# Altium schematic sheet NB-IoT_1.0.0_final.SchDoc
size 584 x 381 mm
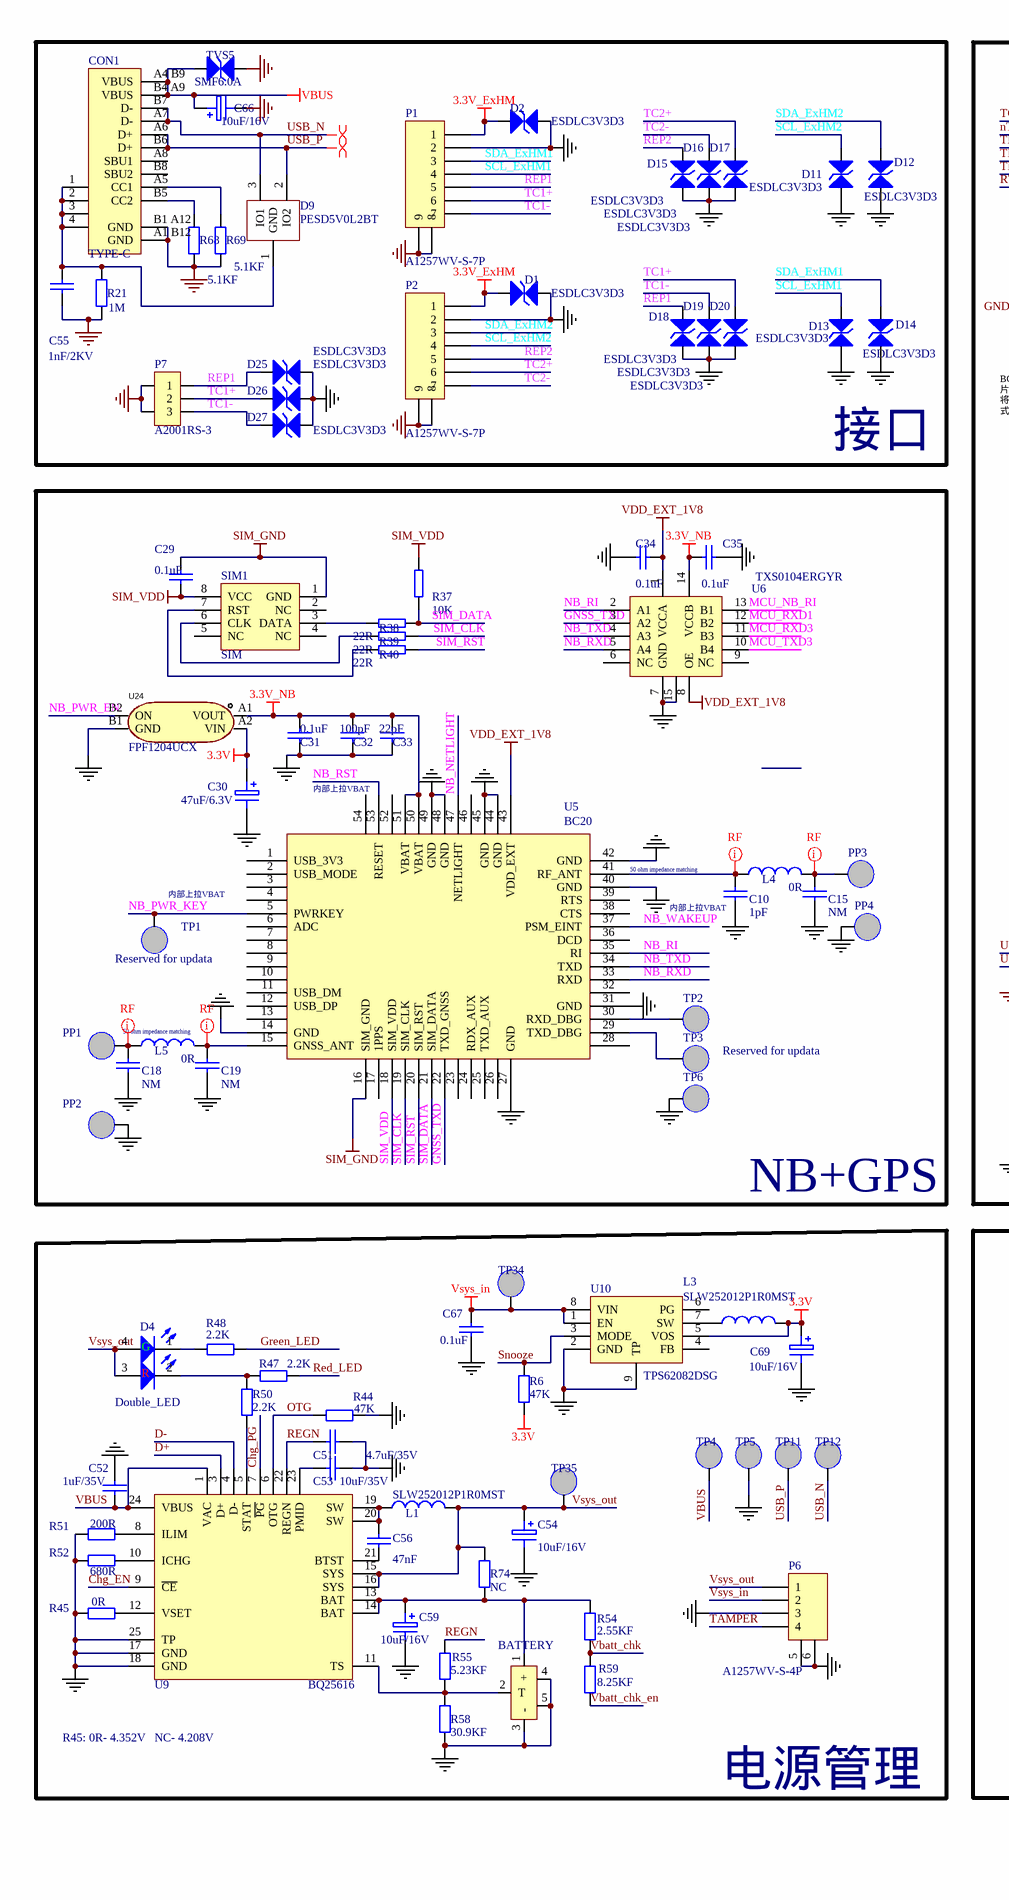
[diagram p0: NB-IoT_1.0.0_final.SchDoc, left]
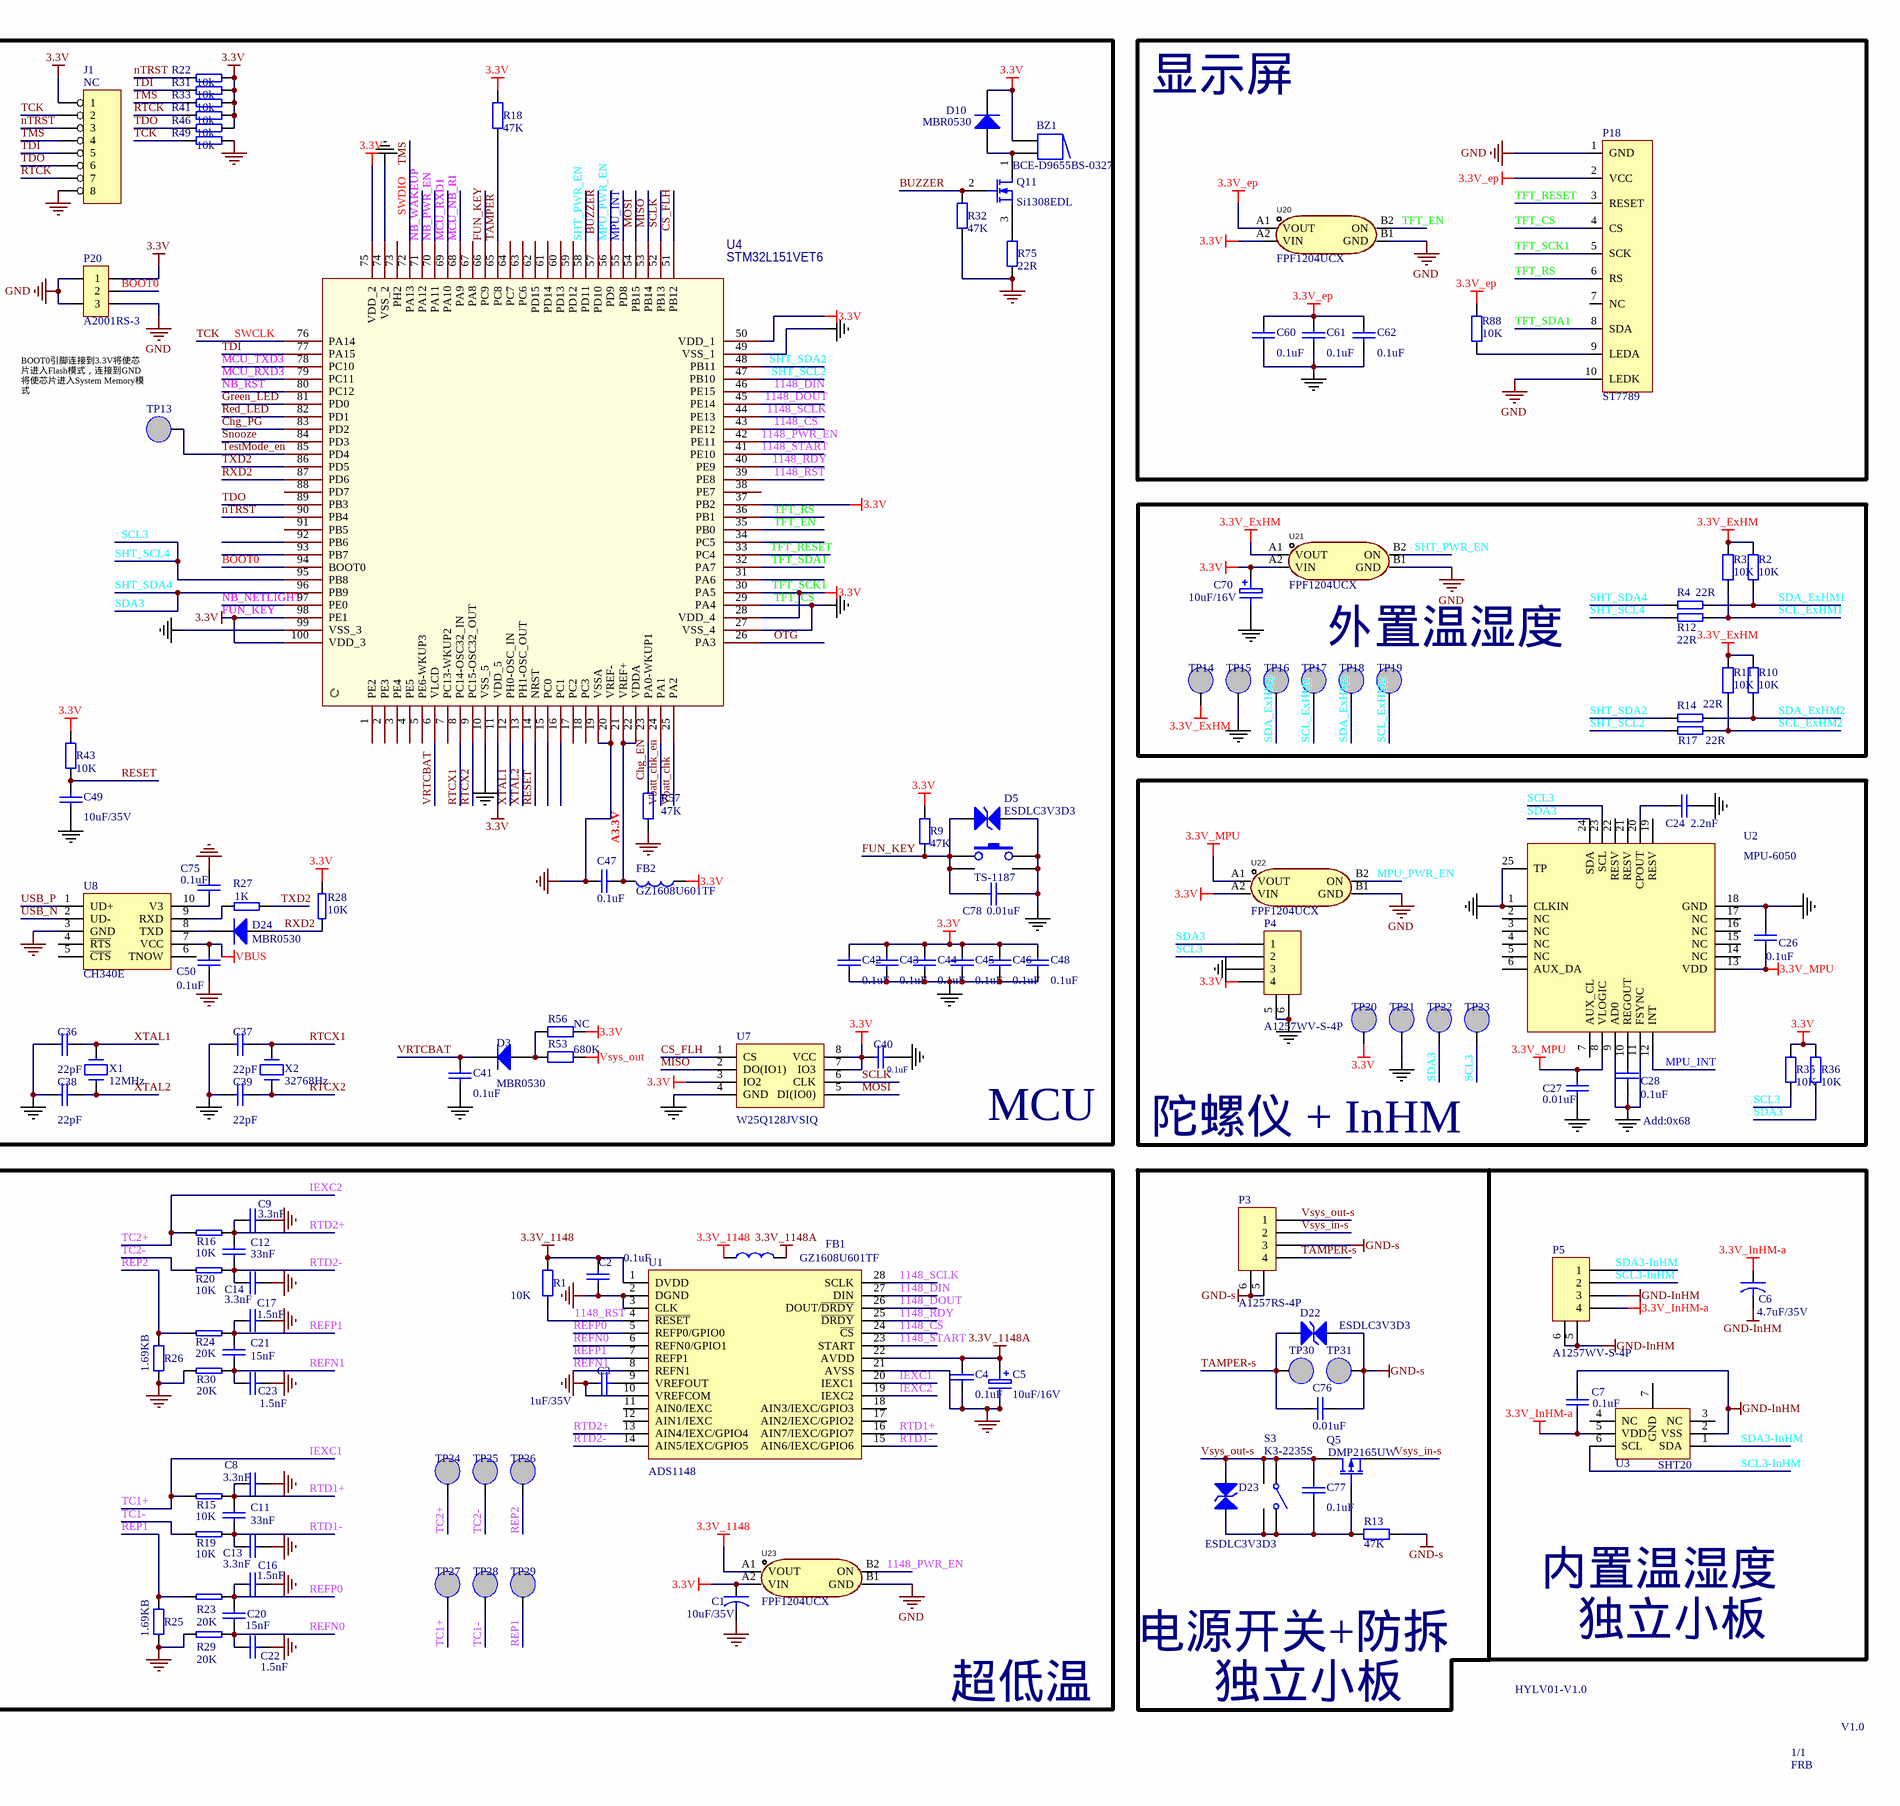
[diagram p1: NB-IoT_1.0.0_final.SchDoc, right]

## Parts
BT1  BATTERY  [2.0T-3P]
BZ1  BCE-D9655BS-0327  [BCE-D9655BS-0327]
C1  10uF/35V  [0805]
C2  0.1uF  [C0402]
C3  1uF/35V  [C0402]
C4  0.1uF  [C0402]
C5  10uF/16V  [3216]
C6  4.7uF/35V  [0603]
C7  0.1uF  [C0402]
C8  3.3nF  [C0402]
C9  3.3nF  [C0402]
C10  1pF  [C0402]
C11  33nF  [C0402]
C12  33nF  [C0402]
C13  3.3nF  [C0402]
C14  3.3nF  [C0402]
C15  NM  [C0402]
C16  1.5nF  [C0402]
C17  1.5nF  [C0402]
C18  NM  [C0402]
C19  NM  [C0402]
C20  15nF  [C0402]
C21  15nF  [C0402]
C22  1.5nF  [C0402]
C23  1.5nF  [C0402]
C24  2.2nF  [C0402]
C26  0.1uF  [C0402]
C27  0.01uF  [C0402]
C28  0.1uF  [C0402]
C29  0.1uF  [C0402]
C30  47uF/6.3V  [3216]
C31  0.1uF  [C0402]
C32  100pF  [C0402]
C33  22pF  [C0402]
C34  0.1uF  [C0402]
C35  0.1uF  [C0402]
C36  22pF  [C0402]
C37  22pF  [C0402]
C38  22pF  [C0402]
C39  22pF  [C0402]
C40  0.1uF  [C0402]
C41  0.1uF  [C0402]
C42  0.1uF  [C0402]
C43  0.1uF  [C0402]
C44  0.1uF  [C0402]
C45  0.1uF  [C0402]
C46  0.1uF  [C0402]
C47  0.1uF  [C0402]
C48  0.1uF  [C0402]
C49  10uF/35V  [0805]
C50  0.1uF  [C0402]
C51  4.7uF/35V  [0603]
C52  1uF/35V  [C0402]
C53  10uF/35V  [0805]
C54  10uF/16V  [3216]
C55  1nF/2KV  [1206]
C56  47nF  [C0402]
C59  10uF/16V  [3216]
C60  0.1uF  [C0402]
C61  0.1uF  [C0402]
C62  0.1uF  [C0402]
C66  10uF/16V  [3216]
C67  0.1uF  [C0402]
C69  10uF/16V  [3216]
C70  10uF/16V  [3216]
C75  0.1uF  [C0402]
C76  0.01uF  [C0402]
C77  0.1uF  [C0402]
C78  0.01uF  [C0402]
CON1  TYPE-C  [TypeC_L-1]
D1  ESDLC3V3D3  [SOD-323]
D2  ESDLC3V3D3  [SOD-323]
D3  MBR0530  [SOD-123]
D4  Double_LED  [LED0805D]
D5  ESDLC3V3D3  [SOD-323]
D9  PESD5V0L2BT  [SOT-23]
D10  MBR0530  [SOD-123]
D11  ESDLC3V3D3  [SOD-323]
D12  ESDLC3V3D3  [SOD-323]
D13  ESDLC3V3D3  [SOD-323]
D14  ESDLC3V3D3  [SOD-323]
D15  ESDLC3V3D3  [SOD-323]
D16  ESDLC3V3D3  [SOD-323]
D17  ESDLC3V3D3  [SOD-323]
D18  ESDLC3V3D3  [SOD-323]
D19  ESDLC3V3D3  [SOD-323]
D20  ESDLC3V3D3  [SOD-323]
D22  ESDLC3V3D3  [SOD-323]
D23  ESDLC3V3D3  [SOD-323]
D24  MBR0530  [SOD-123]
D25  ESDLC3V3D3  [SOD-323]
D26  ESDLC3V3D3  [SOD-323]
D27  ESDLC3V3D3  [SOD-323]
FB1  GZ1608U601TF  [0603]
FB2  GZ1608U601TF  [0603]
J1  NC  [1.25*8]
L1  SLW252012P1R0MST  [2520]
L3  SLW252012P1R0MST  [2520]
L4  0R  [0402]
L5  0R  [0402]
P1  A1257WV-S-7P  [A1257WV-S-7P]
P2  A1257WV-S-7P  [A1257WV-S-7P]
P3  A1257RS-4P  [A1257WV-S-4P]
P4  A1257WV-S-4P  [A1257WV-S-4P]
P5  A1257WV-S-4P  [A1257WV-S-4P]
P6  A1257WV-S-4P  [A1257WV-S-4P]
P7  A2001RS-3  [2.0T-3P]
P18  ST7789  [FPC-SMD_P0.5-10P_FGS-XJ-H2.0]
P20  A2001RS-3  [2.0T-3P]
PP1  (no value)  [TP2.2]
PP2  (no value)  [TP2.2]
PP3  (no value)  [TP2.2]
PP4  (no value)  [TP2.2]
Q5  DMP2165UW  [SOT-323]
Q11  Si1308EDL  [SOT-323]
R1  10K  [0402]
R2  10K  [0402]
R3  10K  [0402]
R4  22R  [0402]
R6  47K  [0402]
R9  47K  [0402]
R10  10K  [0402]
R11  10K  [0402]
R12  22R  [0402]
R13  47K  [0402]
R14  22R  [0402]
R15  10K  [0402]
R16  10K  [0402]
R17  22R  [0402]
R18  47K  [0402]
R19  10K  [0402]
R20  10K  [0402]
R21  1M  [0603]
R22  10k  [0402]
R23  20K  [0402]
R24  20K  [0402]
R25  1.69KB  [0402]
R26  1.69KB  [0402]
R27  1K  [0402]
R28  10K  [0402]
R29  20K  [0402]
R30  20K  [0402]
R31  10k  [0402]
R32  47K  [0402]
R33  10k  [0402]
R35  10K  [0402]
R36  10K  [0402]
R37  10K  [0402]
R38  22R  [0402]
R39  22R  [0402]
R40  22R  [0402]
R41  10k  [0402]
R43  10K  [0402]
R44  47K  [0402]
R45  0R  [0402]
R46  10k  [0402]
R47  2.2K  [0402]
R48  2.2K  [0402]
R49  10k  [0402]
R50  2.2K  [0402]
R51  200R  [0402]
R52  680R  [0402]
R53  680K  [0402]
R54  2.55KF  [0402]
R55  5.23KF  [0402]
R56  NC  [0402]
R57  47K  [0402]
R58  30.9KF  [0402]
R59  8.25KF  [0402]
R68  5.1KF  [0402]
R69  5.1KF  [0402]
R74  NC  [0805]
R75  22R  [0402]
R88  10K  [0402]
S2  TS-1187  [TS-1187]
S3  K3-2235S  [K3-2235S]
SIM1  SIM  [VQFN8]
TP1  (no value)  [TP1.5]
TP2  (no value)  [TP1.5]
TP3  (no value)  [TP1.5]
TP4  (no value)  [TP1.5]
TP5  (no value)  [TP1.5]
TP6  (no value)  [TP1.5]
TP11  (no value)  [TP1.5]
TP12  (no value)  [TP1.5]
TP13  (no value)  [TP1.5]
TP14  (no value)  [TP1.5]
TP15  (no value)  [TP1.5]
TP16  (no value)  [TP1.5]
TP17  (no value)  [TP1.5]
TP18  (no value)  [TP1.5]
TP19  (no value)  [TP1.5]
TP20  (no value)  [TP1.5]
TP21  (no value)  [TP1.5]
TP22  (no value)  [TP1.5]
TP23  (no value)  [TP1.5]
TP24  (no value)  [TP1.5]
TP25  (no value)  [TP1.5]
TP26  (no value)  [TP1.5]
TP27  (no value)  [TP1.5]
TP28  (no value)  [TP1.5]
TP29  (no value)  [TP1.5]
TP30  (no value)  [TP2.5]
TP31  (no value)  [TP2.5]
TP34  (no value)  [TP1.5]
TP35  (no value)  [TP1.5]
TVS5  SMF6.0A  [SOD-123]
U1  ADS1148  [TSSOP28]
U2  MPU-6050  [QFN-24]
U3  SHT20  [DFN3X3]
U4  STM32L151VET6  [LQFP-100_L14.0-W14.0-P0.50-LS16.0-BL]
U5  BC20  [BC20]
U6  TXS0104ERGYR  [VQFN-14]
U7  W25Q128JVSIQ  [SOL-8]
U8  CH340E  [MSOP-10]
U9  BQ25616  [VQFN-24]
U10  TPS62082DSG  [WSON-8]
U20  FPF1204UCX  [WLCSP-4_L0.85-W0.85-R2-C2-P0.40-BL]
U21  FPF1204UCX  [WLCSP-4_L0.85-W0.85-R2-C2-P0.40-BL]
U22  FPF1204UCX  [WLCSP-4_L0.85-W0.85-R2-C2-P0.40-BL]
U23  FPF1204UCX  [WLCSP-4_L0.85-W0.85-R2-C2-P0.40-BL]
U24  FPF1204UCX  [WLCSP-4_L0.85-W0.85-R2-C2-P0.40-BL]
X1  12MHz  [3225]
X2  32768Hz  [3215]

## Blocks framed on the sheet
接口: C55 C66 CON1 D1 D2 D9 D11-D20 D25-D27 P1 P2 P7 R21 R68 R69 TVS5
MCU: BZ1 C36-C50 C75 C78 D3 D5 D10 D24 FB2 J1 P20 Q11 R9 R18 R22 R27 R28 R31-R33 R41 R43 R46 R49 R53 R56 R57 R75 S2 TP13 U4 U7 U8 X1 X2
显示屏: C60-C62 P18 R88 U20
NB+GPS: C10 C15 C18 C19 C29-C35 L4 L5 PP1-PP4 R37-R40 SIM1 TP1-TP3 TP6 U5 U6 U24
外置温湿度: C70 R2-R4 R10-R12 R14 R17 TP14-TP19 U21
陀螺仪 + InHM: C24 C26-C28 P4 R35 R36 TP20-TP23 U2 U22
电源管理: BT1 C51-C54 C56 C59 C67 C69 D4 L1 L3 P6 R6 R44 R45 R47 R48 R50-R52 R54 R55 R58 R59 R74 TP4 TP5 TP11 TP12 TP34 TP35 U9 U10
超低温: C1-C5 C8 C9 C11-C14 C16 C17 C20-C23 FB1 R1 R15 R16 R19 R20 R23-R26 R29 R30 TP24-TP29 U1 U23

## Nets
3.3V_1148: C2.1 FB1.2 R1.1 U1.1(DVDD) U23.A1(VOUT)
3.3V_1148A: C4.1 C5.1 FB1.1 U1.22(AVDD)
3.3V_ep: C60.1 C61.1 C62.1 P18.2(VCC) R88.2 U20.A1(VOUT)
3.3V_ExHM: D1.2(K) D2.2(K) P1.1 P2.1 R2.2 R3.2 R10.2 R11.2 TP14.1 U21.A1(VOUT)
3.3V_InHM-a: C6.1 C7.2 P5.4 U3.5(VDD)
3.3V_MPU: C26.1 C27.2 U2.8(VLOGIC) U2.13(VDD) U22.A1(VOUT)
3.3V_NB: C31.2 C32.2 C33.2 C35.2 U5.50(VBAT) U5.51(VBAT) U6.14(VCCB) U24.A1(VOUT)
FUN_KEY: BZ1.1 C1.1 C30.1 C40.2 C42.1 C43.1 C44.1 C45.1 C46.1 C48.1 C69.1 C70.1 C78.1 D5.2(K) D10.2(K) FB2.1 J1.1 L3.2 P4.4 P18.5(SCK) P20.1 R6.1 R9.1 R9.2 R18.2 R22.2 R28.2 R31.2 R33.2 R35.2 R36.2 R41.2 R43.2 R46.2 R56.1 S2.1 S2.2 TP20.1 U4.11(VDD_5) U4.28(VDD_4) U4.30(PA5) U4.37(PB2) U4.50(VDD_1) U4.66(PC9) U4.75(VDD_2) U4.98(PE1) U4.100(VDD_3) U7.3(IO2) U7.7(IO3) U7.8(VCC) U10.5(VOS) U20.A2(VIN) U21.A2(VIN) U22.A2(VIN) U23.A2(VIN) U24.A2(VIN)  [also labelled 3.3V, TFT_SCK1]
GND-InHM: C6.2 C7.1 P5.3 P5.5 P5.6 U3.2(VSS)
GND-s: C76.2 D22.1(A) P3.3 P3.5 P3.6 R13.1 TP31.1
SIM_GND: C29.1 SIM1.1(GND) U5.16(SIM_GND)
SIM_VDD: C29.2 R37.2 SIM1.8(VCC) U5.18(SIM_VDD)
TFT_CS: BT1.3(-) BT1.4 BT1.5 C1.2 C2.2 C3.1 C4.2 C5.2 C8.2 C9.2 C10.1 C13.2 C14.2 C15.1 C16.2 C17.2 C18.1 C19.1 C22.2 C23.2 C24.2 C26.2 C27.1 C28.1 C30.2 C31.1 C32.1 C33.1 C34.2 C35.1 C36.1 C37.1 C38.1 C39.1 C40.1 C41.2 C42.2 C43.2 C44.2 C45.2 C46.2 C47.2 C48.2 C49.2 C50.2 C51.1 C52.2 C53.1 C54.2 C55.1 C59.2 C60.2 C61.2 C62.2 C66.2 C67.2 C69.2 C70.2 C75.1 C78.2 CON1.A1_B12(GND) CON1.B1_A12(GND) D1.1(A) D2.1(A) D5.1(A) D11.1(A) D12.1(A) D13.1(A) D14.1(A) D15.1(A) D16.1(A) D17.1(A) D18.1(A) D19.1(A) D20.1(A) D25.1(A) D26.1(A) D27.1(A) J1.8 P1.2 P1.8 P1.9 P2.2 P2.8 P2.9 P4.3 P4.5 P4.6 P6.3 P6.5 P6.6 P7.4 P7.5 P18.1(GND) P18.4(CS) P18.10(LEDK) P20.3 P20.4 P20.5 PP2.1 PP4.1 R21.1 R25.1 R26.1 R29.2(vs) R30.2(vs) R32.1 R44.1 R45.1 R49.2 R51.1 R52.1 R57.1 R58.1 R68.1 R69.1 R75.1 S2.3 S2.4 TP5.1 TP6.1 TP15.1 TP21.1 TVS5.1(A) U1.2(DGND) U1.3(CLK) U1.10(VREFCOM) U1.21(AVSS) U2.1(CLKIN) U2.9(AD0) U2.11(FSYNC) U2.18(GND) U2.25(TP) U4.10(VSS_5) U4.19(VSSA) U4.20(VREF-) U4.27(VSS_4) U4.29(PA4) U4.49(VSS_1) U4.74(VSS_2) U4.99(VSS_3) U5.14(GND) U5.27(GND) U5.31(GND) U5.40(GND) U5.42(GND) U5.44(GND) U5.45(GND) U5.48(GND) U5.49(GND) U6.7(GND) U6.15 U7.4(GND) U8.3(GND) U9.17(GND) U9.18(GND) U9.25(TP) U10.2(GND) U10.9(TP) U20.B1(GND) U21.B1(GND) U22.B1(GND) U23.B1(GND) U24.B1(GND)  [also labelled GND]
VBUS: C50.1 C52.1 C66.1 CON1.A4_B9(VBUS) CON1.B4_A9(VBUS) TP4.1 TVS5.2(K) U8.7(VCC) U9.1(VAC) U9.24(VBUS)
VDD_EXT_1V8: C34.1 U5.43(VDD_EXT) U6.1(VCCA) U6.8(OE)
Vsys_in: C67.1 P6.2 TP34.1 U10.1(EN) U10.8(VIN)
Vsys_out: C54.1 D4.3 D4.4 L1.2 P6.1 R53.2 R74.1 TP35.1 U9.15(SYS) U9.16(SYS)
1148_~{CS}: U1.24(~{CS}) U4.43(PE12)
1148_DIN: U1.27(DIN) U4.46(PE15)
1148_DOUT: U1.26(DOUT/~{DRDY}) U4.45(PE14)
1148_PWR_EN: U4.42(PE11) U23.B2(ON)
1148_RDY: U1.25(~{DRDY}) U4.40(PE9)
1148_RST: R1.2 U1.4(~{RESET}) U4.39(PE8)
1148_SCLK: U1.28(SCLK) U4.44(PE13)
1148_START: U1.23(START) U4.41(PE10)
A3.3V: C47.1 FB2.2 U4.21(VREF+) U4.22(VDDA)
BOOT0: P20.2 U4.94(BOOT0)
BUZZER: Q11.2(G) R32.2 U4.57(PD10)
Chg_EN: R57.2 U4.23(PA0-WKUP1) U9.9(~{CE})
Chg_PG: U4.83(PD2) U9.7(~{PG})
CS_FLH: U4.51(PB12) U7.1(CS)
D+: U9.3(D+)
D-: U9.4(D-)
GNSS_TXD: U5.22(TXD_GNSS) U6.3(A2)
Green_LED: R48.1 U4.81(PD0)
IEXC1: D20.2(K) D26.2(K) P1.6 P7.2 R15.2(vs) TP27.1 U1.20(IEXC1)  [also labelled TC1+]
IEXC2: D17.2(K) P2.6 R16.2(vs) TP24.1 U1.19(IEXC2)  [also labelled TC2+]
MCU_NB_RI: U4.68(PA9) U6.13(B1)
MCU_RXD1: U4.69(PA10) U6.12(B2)
MCU_RXD3: U4.79(PC11) U6.11(B3)
MCU_TXD3: U4.78(PC10) U6.10(B4)
MISO: U4.53(PB14) U7.2(DO(IO1))
MOSI: U4.54(PB15) U7.5(DI(IO0))
MPU_INT: U2.12(INT) U4.55(PD8)
MPU_PWR_EN: U4.56(PD9) U22.B2(ON)
NB_NETLIGHT: U4.97(PE0) U5.47(NETLIGHT)
NB_PWR_EN: U4.70(PA11) U24.B2(ON)
NB_PWR_KEY: TP1.1 U5.5(PWRKEY)
NB_RI: U5.35(RI) U6.2(A1)
NB_RST: U4.80(PC12) U5.53(RESET)
NB_RXD: U5.33(RXD) U6.5(A4)
NB_TXD: U5.34(TXD) U6.4(A3)
NB_WAKEUP: U4.71(PA12) U5.37(PSM_EINT)
nTRST: J1.3 R22.1 U4.90(PB4)
OTG: R44.2 U4.26(PA3) U9.6(OTG)
Red_LED: R47.1 U4.82(PD1)
REFN0: C20.2 C22.1 R29.1(vs) U1.6(REFN0/GPIO1)
REFN1: C21.2 C23.1 R30.1(vs) U1.8(REFN1)
REFP0: C16.1 C20.1 R23.1(vs) U1.5(REFP0/GPIO0)
REFP1: C17.1 C21.1 R24.1(vs) U1.7(REFP1)
REGN: C51.2 R55.1 U9.22(REGN)
REP1: D18.2(K) D25.2(K) P1.5 P7.1 R23.2(vs) R25.2 TP29.1
REP2: D15.2(K) P2.5 R24.2(vs) R26.2 TP26.1
RESET: C49.1 R43.1 U4.14(NRST)
RTCK: J1.7 R41.1
RTCX1: C37.2 U4.8(PC14-OSC32_IN) X2.2
RTCX2: C39.2 U4.9(PC15-OSC32_OUT) X2.1
RTD1+: C8.1 C11.1 R15.1(vs) U1.16(AIN7/IEXC/GPIO7)
RTD1-: C11.2 C13.1 R19.1(vs) U1.15(AIN6/IEXC/GPIO6)
RTD2+: C9.1 C12.1 R16.1(vs) U1.13(AIN4/IEXC/GPIO4)
RTD2-: C12.2 C14.1 R20.1(vs) U1.14(AIN5/IEXC/GPIO5)
RXD2: D24.1(A) R28.1 U4.87(PD6)
SCL3: P4.2 R12.2 R35.1 TP23.1 U2.23(SCL) U4.95(PB8)  [also labelled SHT_SCL4]
SCL3-InHM: P5.2 U3.6(SCL)
SCL_ExHM1: D13.2(K) P1.4 R3.1 R12.1 TP17.1
SCL_ExHM2: D11.2(K) P2.4 R11.1 R17.1 TP19.1
SCLK: U4.52(PB13) U7.6(CLK)
SDA3: P4.1 R4.2 R36.1 TP22.1 U2.24(SDA) U4.96(PB9)  [also labelled SHT_SDA4]
SDA3-InHM: P5.1 U3.1(SDA)
SDA_ExHM1: D14.2(K) P1.3 R2.1 R4.1 TP16.1
SDA_ExHM2: D12.2(K) P2.3 R10.1 R14.1 TP18.1
SHT_PWR_EN: U4.58(PD11) U21.B2(ON)
SHT_SCL2: R17.2 U4.47(PB10)
SHT_SDA2: R14.2 U4.48(PB11)
SIM_CLK: R39.2 U5.19(SIM_CLK)
SIM_DATA: R37.1 R38.2 U5.21(SIM_DATA)
SIM_RST: R40.2 U5.20(SIM_RST)
Snooze: R6.2 U4.84(PD3) U10.3(MODE)
SWCLK: J1.2 R49.1 U4.76(PA14)  [also labelled TCK]
SWDIO: J1.4 R33.1 U4.72(PA13)  [also labelled TMS]
TAMPER: P6.4 R18.1 U4.65(PC8)
TAMPER-s: C76.1 D22.2(K) P3.4 TP30.1
TC1-: D19.2(K) D27.2(K) P1.7 P7.3 R19.2(vs) TP28.1
TC2-: D16.2(K) P2.7 R20.2(vs) TP25.1
TDI: J1.5 R31.1 U4.77(PA15)
TDO: J1.6 R46.1 U4.89(PB3)
TestMode_en: TP13.1 U4.85(PD4)
TFT_EN: U4.35(PB0) U20.B2(ON)
TFT_RESET: P18.3(RESET) U4.33(PC4)
TFT_RS: P18.6(RS) U4.36(PB1)
TFT_SDA1: P18.8(SDA) U4.32(PA7)
TXD2: R27.2 U4.86(PD5)
USB_N: CON1.A7(D-) CON1.B7(D-) D9.3(IO1) TP12.1 U8.2(UD-)
USB_P: CON1.A6(D+) CON1.B6(D+) D9.2(IO2) TP11.1 U8.1(UD+)
Vbatt_chk: R54.2 R59.1 U4.25(PA2)
Vbatt_chk_en: R59.2 U4.24(PA1)
VRTCBAT: C41.1 D3.2(K) U4.6(VLCD)
Vsys_in-s: P3.2 Q5.1(S)
Vsys_out-s: C77.1 D23.2(K) P3.1 Q5.3(D) S3.1(COMMON) S3.2(COMMON)
XTAL1: C36.2 U4.12(PH0-OSC_IN) X1.2
XTAL2: C38.2 U4.13(PH1-OSC_OUT) X1.1
NetBT1_1: BT1.1(+) C59.1 R54.1 R74.2 U9.13(BAT) U9.14(BAT)
NetBT1_2: BT1.2(T) R55.2 R58.2 U9.11(TS)
NetBZ1_2: BZ1.2 D10.1(A) Q11.1(D)
NetC3_2: C3.2 U1.9(VREFOUT)
NetC10_2: C10.2 L4.1 U5.41(RF_ANT)
NetC15_2: C15.2 L4.2 PP3.1
NetC18_2: C18.2 L5.1 PP1.1
NetC19_2: C19.2 L5.2 U5.15(GNSS_ANT)
NetC24_1: C24.1 U2.20(CPOUT)
NetC28_2: C28.2 U2.10(REGOUT)
NetC53_2: C53.2 U9.23(PMID)
NetC55_2: C55.2 CON1.1 CON1.2 CON1.3 CON1.4 D9.1(GND) R21.2
NetC56_1: C56.1 L1.1 U9.19(SW) U9.20(SW)
NetC56_2: C56.2 U9.21(BTST)
NetC75_2: C75.2 U8.10(V3)
NetC77_2: C77.2 D23.1(A) Q5.2(G) R13.2 S3.3(NO) S3.4(NO)
NetCON1_A5: CON1.A5(CC1) R69.2
NetCON1_B5: CON1.B5(CC2) R68.2
NetD3_1: D3.1(A) R53.1 R56.2
NetD4_1: D4.1 R48.2
NetD4_2: D4.2 R47.2 R50.1
NetD24_2: D24.2(K) U8.8(TXD)
NetL3_1: L3.1 U10.7(SW)
NetP18_9: P18.9(LEDA) R88.1
NetQ11_3: Q11.3(S) R75.2
NetR27_1: R27.1 U8.9(RXD)
NetR38_1: R38.1 SIM1.3(DATA)
NetR39_1: R39.1 SIM1.6(CLK)
NetR40_1: R40.1 SIM1.7(RST)
NetR45_2: R45.2 U9.12(VSET)
NetR50_2: R50.2 U9.5(STAT)
NetR51_2: R51.2 U9.8(ILIM)
NetR52_2: R52.2 U9.10(ICHG)
NetTP2_1: TP2.1 U5.30(RXD_DBG)
NetTP3_1: TP3.1 U5.29(TXD_DBG)

Not connected (* = marked no-connect by the designer): CON1 A8(SBU1) B8(SBU2); P18 7(NC); SIM1 2(NC) 4(NC) 5(NC); U1 11(AIN0/IEXC) 12(AIN1/IEXC) 17(AIN2/IEXC/GPIO2) 18(AIN3/IEXC/GPIO3); U2 2(NC) 3(NC) 4(NC) 5(NC) 6(AUX_DA) 7(AUX_CL) 14(NC) 15(NC) 16(NC) 17(NC) 19(RESV) 21(RESV) 22(RESV); U3 3(NC) 4(NC) 7(GND); U4 1(PE2) 2(PE3) 3(PE4) 4(PE5) 5(PE6-WKUP3) 7(PC13-WKUP2) 15(PC0) 16(PC1) 17(PC2) 18(PC3) 31(PA6) 34(PC5) 38(PE7) 59(PD12) 60(PD13) 61(PD14) 62(PD15) 63(PC6) 64(PC7) 67(PA8) 73(PH2) 88(PD7) 91(PB5) 92(PB6) 93(PB7); U5 1(USB_3V3) 2(USB_MODE) 3 4 6(ADC) 7 8 9 10 11(USB_DM) 12(USB_DP) 13 17(1PPS) 23 24(RDX_AUX) 25(TXD_AUX) 26 28 32 36(DCD) 38(CTS) 39(RTS) 46 52 54; U6 6(NC) 9(NC); U8 4(~{RTS}) 5(~{CTS}) 6(TNOW); U10 4(FB) 6(PG)

## Layout directives
differential pair: USB_N, USB_P
net class RF: NetC10_2, NetC15_2, NetC18_2, NetC19_2

## Notes on the sheet
- BOOT0引脚连接到3.3V将使芯片进入Flash模式，连接到GND将使芯片进入System Memory模式
- 内部上拉VBAT
- 50 ohm impedance matching
- (near TP1) 内部上拉VBAT
- (near C10) 内部上拉VBAT
- (near TP1) Reserved for updata
- Reserved for updata
- (near C28) Add:0x68
- (near D4) G
- (near D4) R
- 内置温湿度
- 独立小板
- R45: 0R- 4.352V   NC- 4.208V
- 电源开关+防拆
- HYLV01-V1.0
- 1/1
- FRB
- V1.0

## Library data of the parts
BT1 = BATT
BZ1 = Buzzer: Magnetic Transducer Buzzer; Published: 24-Mar-1999; LatestRevisionDate: 17-Dec-2003; LatestRevisionNote: Schematic revised, PCB Footprint replaced.; DatasheetVersion: 17-Dec-2003; PackageReference: ABSM-1574; Publisher: Altium Limited; PackageDescription: Magnetic Transducer Buzzer; ComponentLink1Description: Manufacturer Link; ComponentLink1URL: http://www.megastar.com/linecard/buzzmode/index.php
C1 C6 = CAPACITOR
C2-C4 C7-C9 C11-C14 C16 C17 C20-C23 C29 C40-C50 C60-C62 C75-C78 = CAP: Capacitor
C5 C30 C54 C59 C66 C69 C70 = ELECTRO1
C10 C15 C18 C19 C24 C26-C28 C31-C39 C51-C53 C55 C56 C67 = CAP
D1 D2 D5 D11-D20 D22 D23 D25-D27 TVS5 = TVS
D3 D10 D24 = Diode: Default Diode; Published: 8-Jun-2000; LatestRevisionDate: 17-Jul-2002; LatestRevisionNote: Re-released for DXP Platform.; PackageVersion: Sep-1996; PackageReference: SMC; Publisher: Altium Limited; PackageDescription: DO-214-AB/SMC; 2 C-Bend Leads; Body 7.9 x 5.9 mm, inc. leads (LxW); Code_JEDEC: DO-214-AB
D4 = LED_DOUBLE
D9 = ESD2B: PESD15VL2BT
FB1 FB2 = INDUCTOR1
J1 = 8 HEADER: 8 Pin Header
L1 L3-L5 = Inductor: Code_IEC: 1005; Value: 1uH; Published: 8-Jun-2000; LatestRevisionDate: 29-May-2009; LatestRevisionNote: IPC-7351 Footprint Added.; PackageReference: 0402-A; Publisher: Altium Limited; PackageDescription: Chip Inductor; Code_JEITA: 0402
P1 P2 = Header 7: Header, 7-Pin; LatestRevisionDate: 17-Jul-2002; LatestRevisionNote: Re-released for DXP Platform.; Publisher: Altium Limited
P3-P6 = Header 4: Header, 4-Pin; LatestRevisionDate: 17-Jul-2002; LatestRevisionNote: Re-released for DXP Platform.; Publisher: Altium Limited
PP1-PP4 TP1-TP6 TP11-TP31 TP34 TP35 = tp
Q5 = MOSFET-P: P-Channel MOSFET; Published: 8-Jun-2000; LatestRevisionDate: 17-Jul-2002; LatestRevisionNote: Re-released for DXP Platform.; PackageVersion: 1995/1996; PackageReference: E3; Publisher: Altium Limited; PackageDescription: TO, Flat Index; 3 In-Line, Axial Leads; Body Dia. 4.6mm; Lead Dia. 0.5 mm (max)
Q11 = MOSFET-N: N-Channel MOSFET; Published: 8-Jun-2000; LatestRevisionDate: 17-Jul-2002; LatestRevisionNote: Re-released for DXP Platform.; PackageVersion: 1995/1996; PackageReference: E3; Publisher: Altium Limited; PackageDescription: TO, Flat Index; 3 In-Line, Axial Leads; Body Dia. 4.6mm; Lead Dia. 0.5 mm (max)
R1-R3 R6 R9-R11 R13 R18 R21 R25 R26 R32 R35 R36 R43-R45 R47 R48 R50-R59 R68 R69 R74 R75 R88 = Res2: Resistor
  R1-R3 R6 R9-R11 R13 R18 R25 R26 R32 R35 R36 R44 R45 R47 R48 R50-R59 R74 R75 R88: Published: 8-Jun-2000; LatestRevisionDate: 17-Jul-2002; LatestRevisionNote: Re-released for DXP Platform.; PackageReference: 0402; Publisher: Altium Limited; PackageDescription: Axial Device, Thru-Hole; 2 Leads; 0.4 in Pin Spacing
  R21 R68 R69: Published: 8-Jun-2000; LatestRevisionDate: 17-Jul-2002; LatestRevisionNote: Re-released for DXP Platform.; PackageReference: AXIAL-0.4; Publisher: Altium Limited; PackageDescription: Axial Device, Thru-Hole; 2 Leads; 0.4 in Pin Spacing
  R43: Published: *; LatestRevisionDate: *; LatestRevisionNote: *; PackageReference: 0402; Publisher: *; Value: *
R4 R12 R14 R17 R22 R27 R28 R31 R33 R37-R41 R46 R49 = RES2
R15 R16 R19 R20 R23 R24 R29 R30 = RES
S2 = SW-PB
S3 = PWR_SW
SIM1 = SIM_chip
U3 = SHT2X
U4 = STM32L451VET6: Add into BOM: yes; CPU Core: ARM Cortex-M4; CPU Maximum Speed: 80MHz; Operating Voltage Range: 1.71V~3.6V; Program Storage Size: 512KB; Program Memory Type: FLASH; RAM Size: 160KB; GPIO Ports Number: 83; ADC (Bit): 12bit; Name: STM32L451VET6; Symbol: STM32L451VET6; Device: STM32L451VET6; LCSC Part Name: ARM Cortex-M4 80MHz; Supplier Part: C1341459; Manufacturer Part: STM32L451VET6; Supplier Footprint: LQFP-100(14x14); JLCPCB Part Class: Extended Part; Datasheet: https://atta.szlcsc.com/upload/public/pdf/source/20210630/B4DD4319E6C98EEA0533602CD7493DB7.pdf; Supplier: LCSC; Convert to PCB: yes; EEPROM: -; DAC (Bit): 12bit; PWM (Bit): -; Universal Serial Bus: -; Internal Comparator: -; communication protocol: -; Real-Time Clock: -; Low-Voltage Detect: -; CCP Capture/Compare: -; Secure Digital Input and Output: -
U6 = TXS0104
U7 = 25QXXX
U9 = BQ25606
U20-U24 = FPF1204UCX: 功率电子开关; Add into BOM: yes; Name: FPF1204UCX; Symbol: FPF1204UCX; Device: FPF1204UCX; Supplier Part: C232816; Manufacturer Part: FPF1204UCX; Supplier Footprint: WLCSP-4; JLCPCB Part Class: Extended Part; Datasheet: https://atta.szlcsc.com/upload/public/pdf/source/20221020/67909E9F9DD1786048497B7485FE4DEE.pdf; Supplier: LCSC; Convert to PCB: yes
X1 X2 = CRYSTAL